# Altium schematic sheet Accelerometer.SchDoc
size A4; SheetNumber: 3; SheetTotal: 7
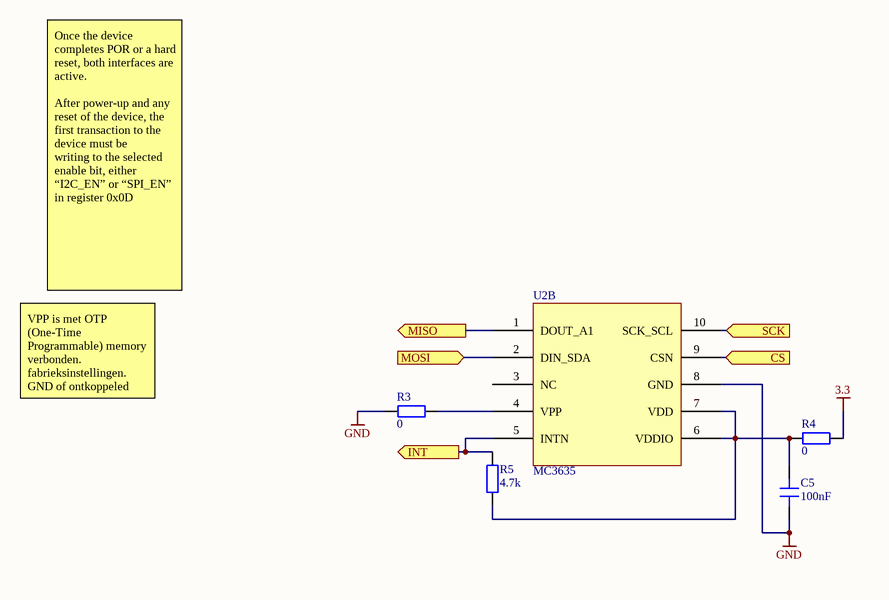
[diagram p0: Accelerometer.SchDoc]

## Parts
C5  100nF  [0603_CAP]
R3  0  [0603]
R4  0  [0603]
R5  4.7k  [0402_RES]
U2  MC3635  [MC3635]  (part B of 2)

## Ports
CS (in, see Smart-Watch-Front[3B]), INT (out, see Smart-Watch-Front[4B]), MISO (out, see Smart-Watch-Front[4B]), MOSI (in, see Smart-Watch-Front[3B]), SCK (in, see Smart-Watch-Front[3B])

## Nets
3.3: R4.1
GND: C5.1 R3.2 U2.8(GND)
CS: U2.9(CSN) ; port CS
INT: R5.2 U2.5(INTN) ; port INT
MISO: U2.1(DOUT_A1) ; port MISO
MOSI: U2.2(DIN_SDA) ; port MOSI
SCK: U2.10(SCK_SCL) ; port SCK
NetC5_2: C5.2 R4.2 R5.1 U2.6(VDDIO) U2.7(VDD)
NetR3_1: R3.1 U2.4(VPP)

Not connected (* = marked no-connect by the designer): U2 3(NC)

## Notes on the sheet
- Once the device completes POR or a hard reset, both interfaces are active.
  After power-up and any reset of the device, the first transaction to the device must be
  writing to the selected enable bit, either “I2C_EN” or “SPI_EN” in register 0x0D
- VPP is met OTP (One-Time Programmable) memory verbonden.
  fabrieksinstellingen.
  GND of ontkoppeled

## Library data of the parts
C5 = C
R3-R5 = R